# Altium project test.prjpcb
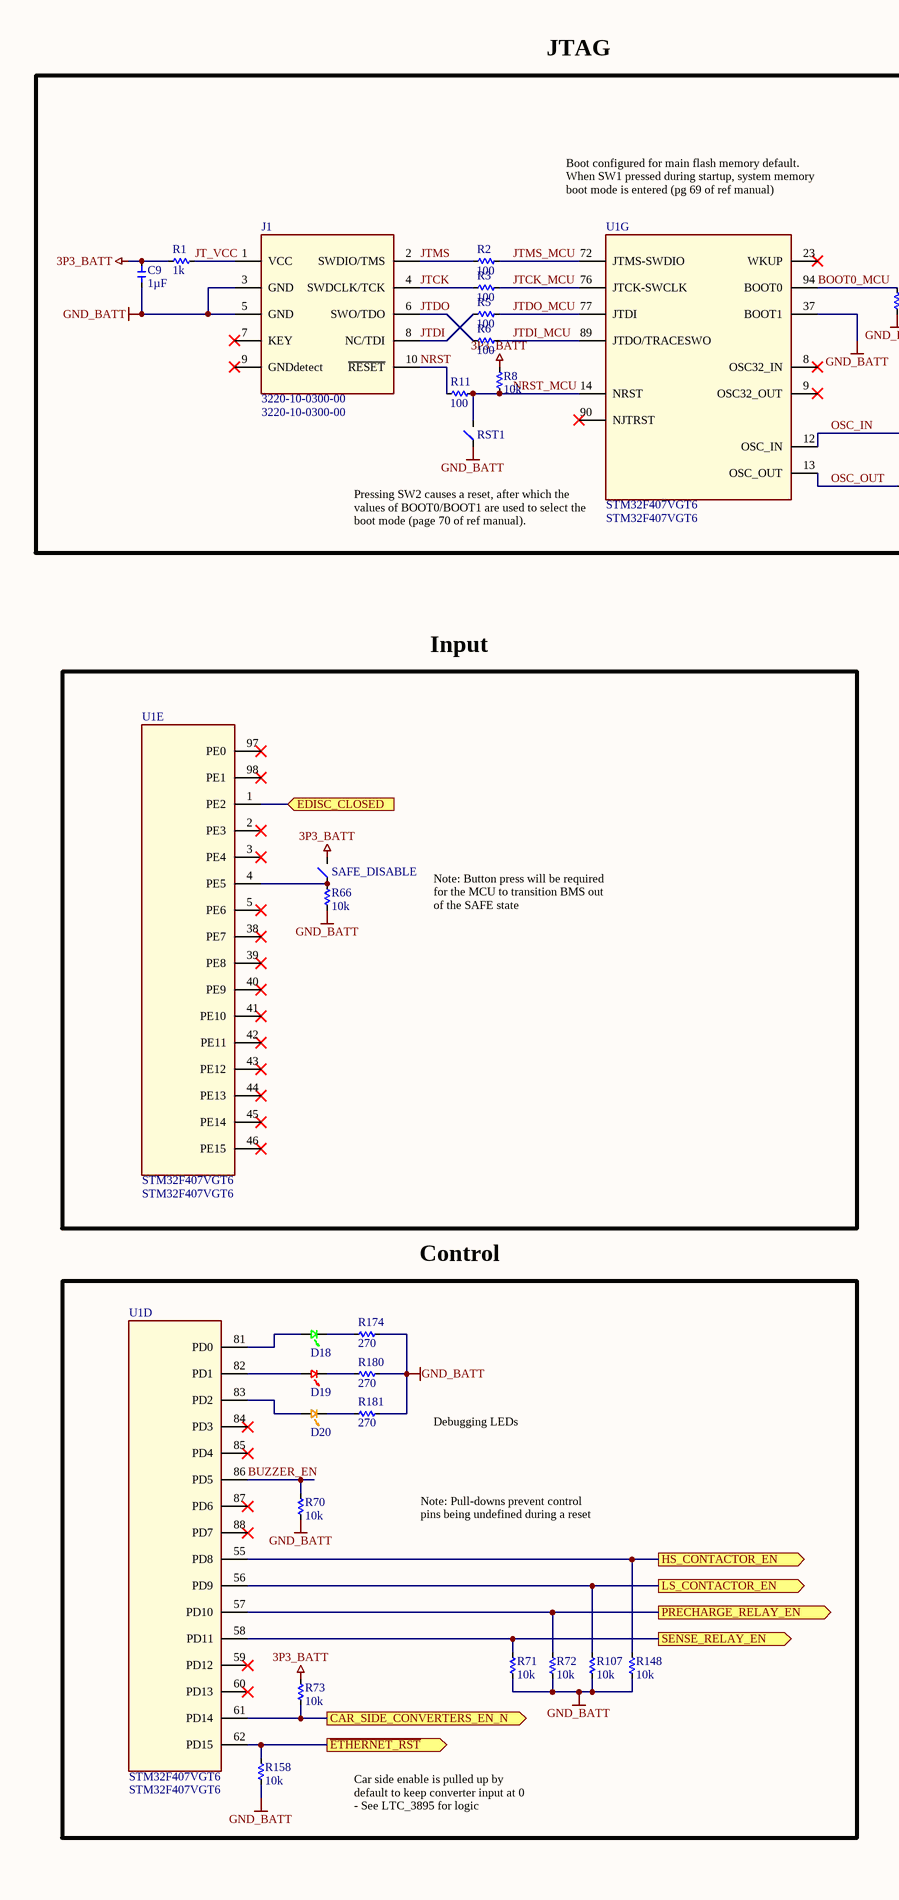
[diagram p0: sheet1.SchDoc, left]
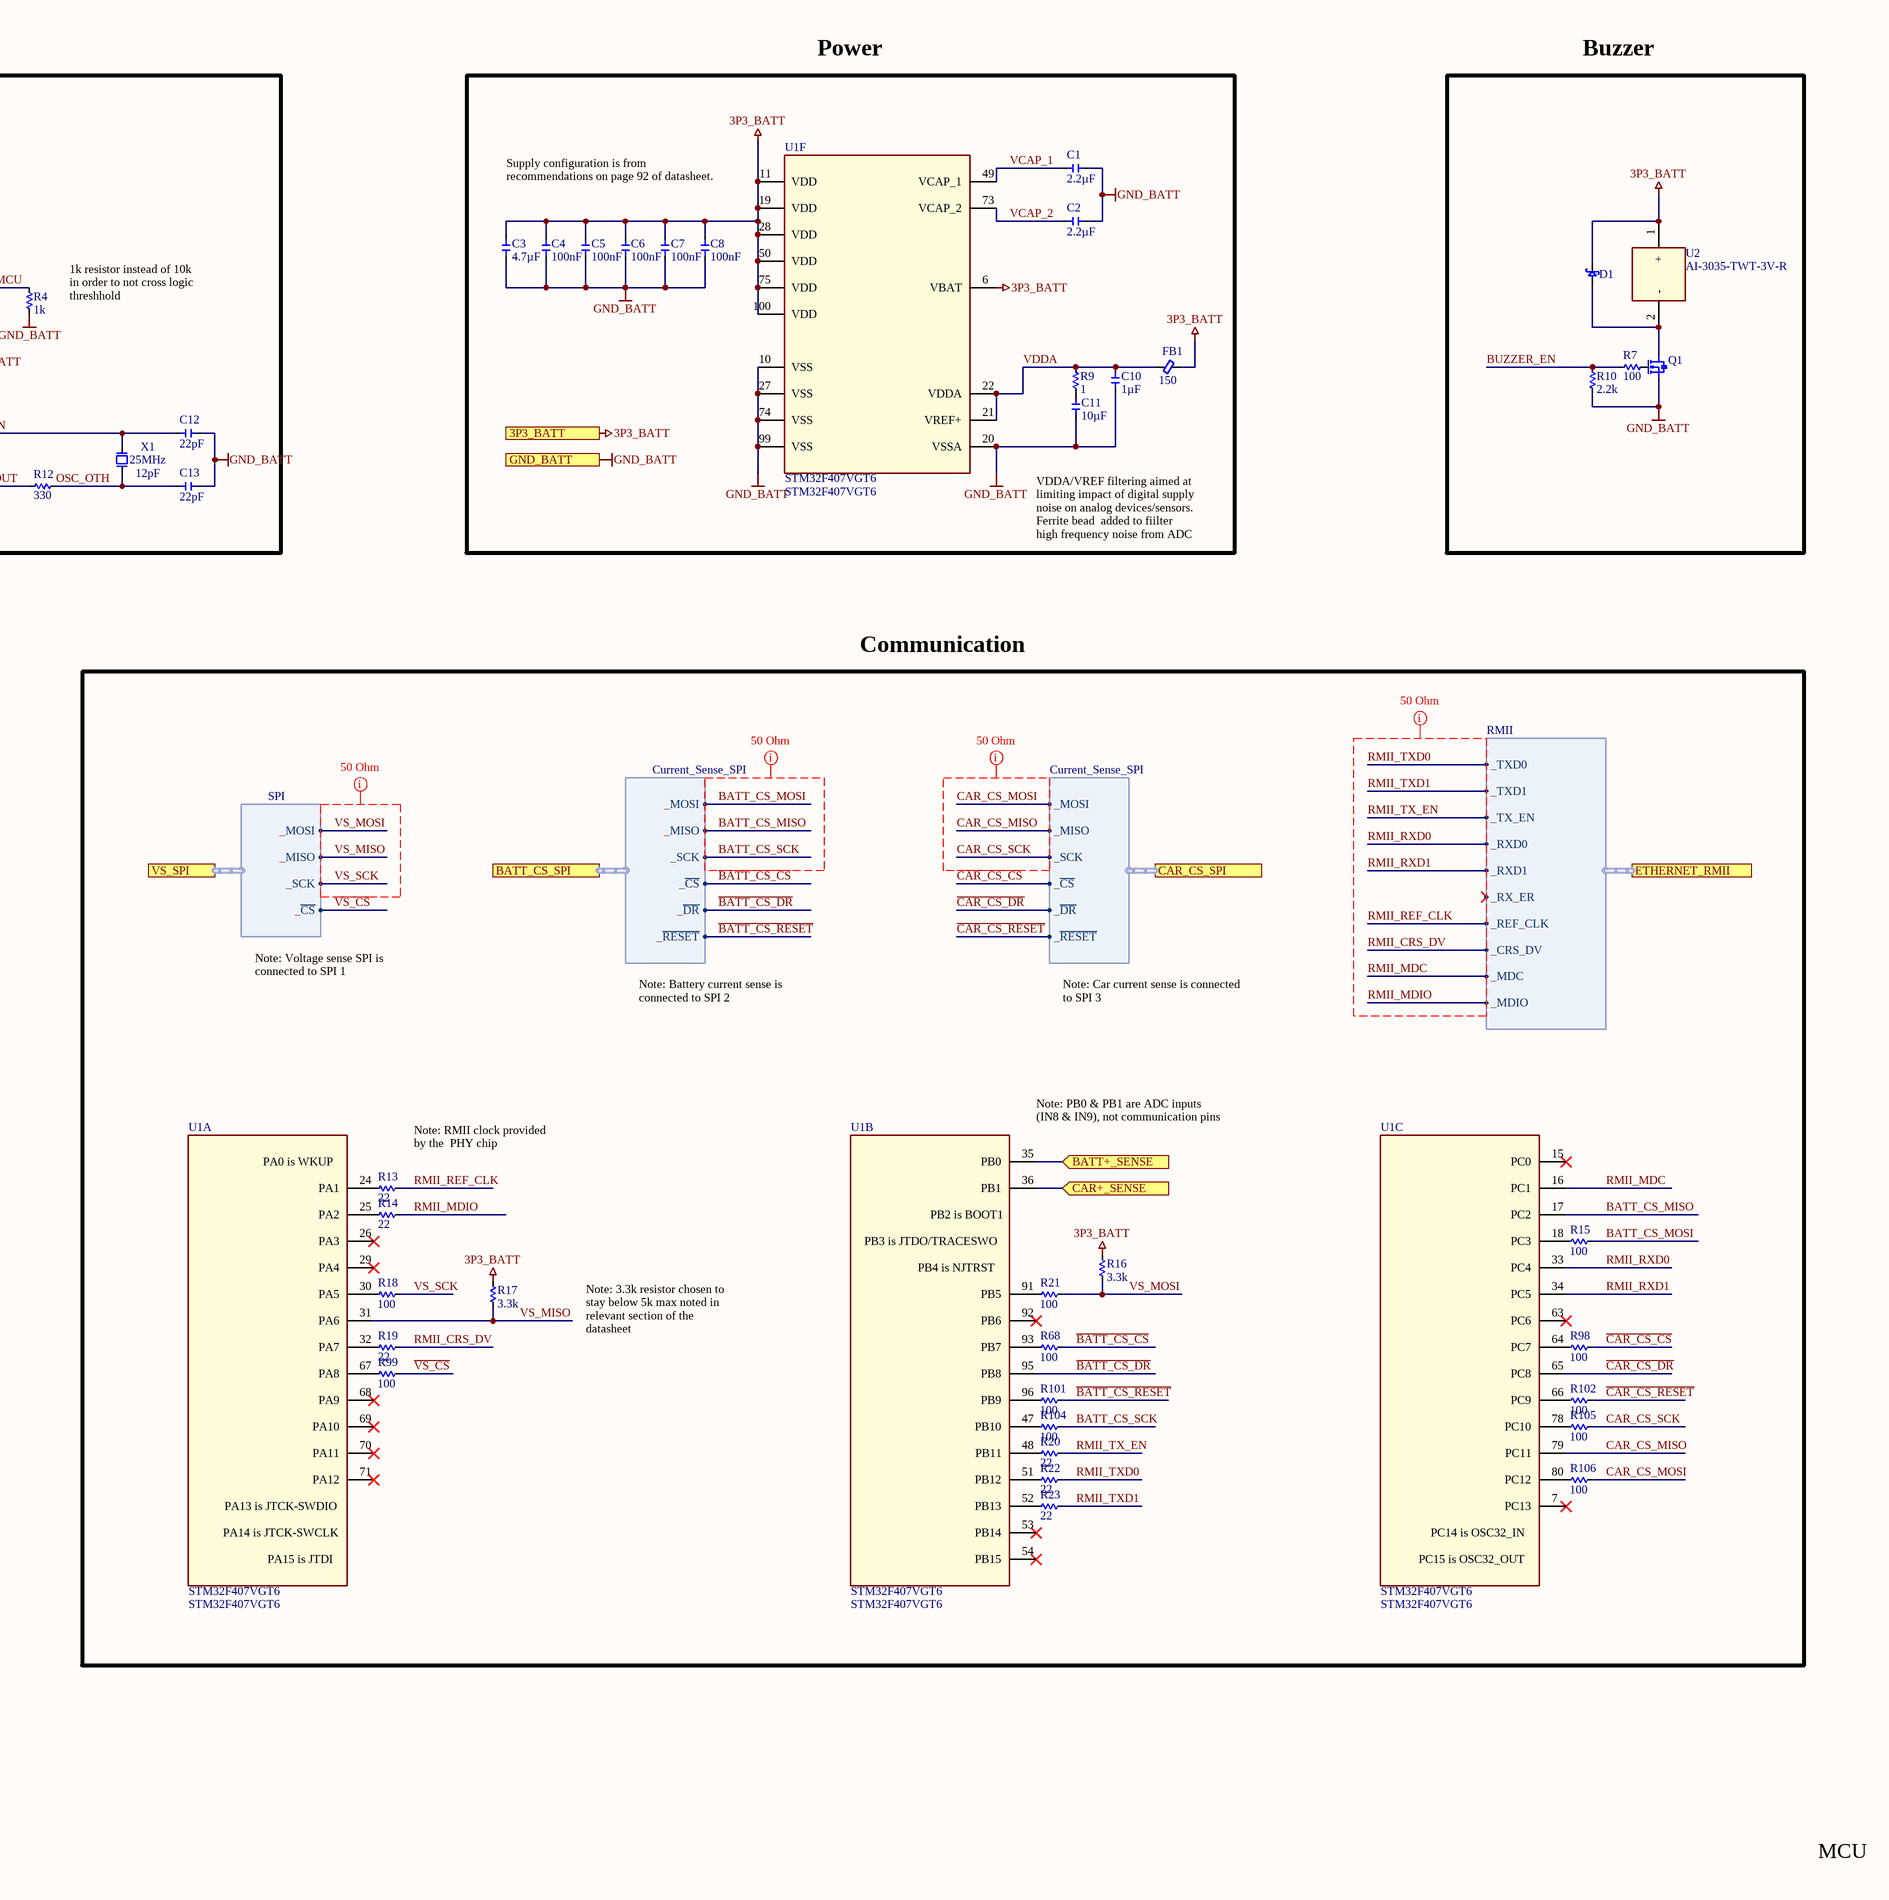
[diagram p1: sheet1.SchDoc, right]
PrjCustomer: My Project; PrjName: BMS_11; PrjPCARev: 1; PrjPCBRev: 1; PrjSVN: 28; PrjYear: 2021
2 sheets, 127 parts. Net scope: strictly hierarchical (ports join the sheet entries above them; power ports are local).
Board file: BMS_11_1_0.PcbDoc
Sheets:
  sheet1.SchDoc
  sheet2.SchDoc

## Sheet sheet1.SchDoc
size 558 x 381 mm; DocumentNumber: 11; SheetNumber: 10; SheetTotal: 19

### Parts
C1  value 2.2µF  [C0603_0.90MM]  (hidden comment: CGA3E1X7S1C225K080AC)
C2  value 2.2µF  [C0603_0.90MM]  (hidden comment: CGA3E1X7S1C225K080AC)
C3  value 4.7µF  [C0805_1.45MM]  (hidden comment: CGA4J3X7R1C475K125AB)
C4  value 100nF  [C0603_0.90MM]  (hidden comment: CGA3E2X7R1H104K080AA)
C5  value 100nF  [C0603_0.90MM]  (hidden comment: CGA3E2X7R1H104K080AA)
C6  value 100nF  [C0603_0.90MM]  (hidden comment: CGA3E2X7R1H104K080AA)
C7  value 100nF  [C0603_0.90MM]  (hidden comment: CGA3E2X7R1H104K080AA)
C8  value 100nF  [C0603_0.90MM]  (hidden comment: CGA3E2X7R1H104K080AA)
C9  value 1µF  [C0805_1.50MM]  (hidden comment: CGA4J3X7R1H105K125AB)
C10  value 1µF  [C0805_1.50MM]  (hidden comment: CGA4J3X7R1H105K125AB)
C11  value 10µF  [C1210_2.80MM]  (hidden comment: CGA6P1X7R1E106K250AC)
C12  value 22pF  [C0603_0.90MM]  (hidden comment: CGA3E2C0G1H220J080AA)
C13  value 22pF  [C0603_0.90MM]  (hidden comment: CGA3E2C0G1H220J080AA)
D1  DFLS130L-7  [DIOD-POWERDI123-2_A_V]  (value not drawn)
D18  LTST-C191KGKT  [LED_0603P_GREEN]  (value not drawn)
D19  LTST-C194KRKT  [LED_0603P_RED]  (value not drawn)
D20  LTST-C194KFKT  [LED_0603P_ORANGE]  (value not drawn)
FB1  Impedance (Ohms @ 100MHz): 150  [FB0603_0.95MM]  (hidden comment: MPZ1608Y151BTD25)
J1  3220-10-0300-00  [3220-10-0300-00]
Q1  BSR802NL6327  [3SOT23]  (value not drawn)
R1  value 1k  [R0603_0.55MM]  (hidden comment: ERJ-PA3F1001V)
R2  value 100  [R0603_0.55MM]  (hidden comment: ERJ-3EKF1000V)
R3  value 100  [R0603_0.55MM]  (hidden comment: ERJ-3EKF1000V)
R4  value 1k  [R0603_0.55MM]  (hidden comment: ERJ-PA3F1001V)
R5  value 100  [R0603_0.55MM]  (hidden comment: ERJ-3EKF1000V)
R6  value 100  [R0603_0.55MM]  (hidden comment: ERJ-3EKF1000V)
R7  value 100  [R0603_0.55MM]  (hidden comment: ERJ-PA3F1000V)
R8  value 10k  [R0603_0.55MM]  (hidden comment: ERJ-3EKF1002V)
R9  value 1  [R0603_0.55MM]  (hidden comment: ERJ-3RQF1R0V)
R10  value 2.2k  [R0603_0.55MM]  (hidden comment: ERJ-PA3F2201V)
R11  value 100  [R0603_0.55MM]  (hidden comment: ERJ-3EKF1000V)
R12  value 330  [R0603_0.55MM]  (hidden comment: ERJ-3EKF3300V)
R13  value 22  [R0603_0.55MM]  (hidden comment: ERJ-3EKF22R0V)
R14  value 22  [R0603_0.55MM]  (hidden comment: ERJ-3EKF22R0V)
R15  value 100  [R0603_0.55MM]  (hidden comment: ERJ-3EKF1000V)
R16  value 3.3k  [R0603_0.55MM]  (hidden comment: ERJ-3EKF3301V)
R17  value 3.3k  [R0603_0.55MM]  (hidden comment: ERJ-3EKF3301V)
R18  value 100  [R0603_0.55MM]  (hidden comment: ERJ-3EKF1000V)
R19  value 22  [R0603_0.55MM]  (hidden comment: ERJ-3EKF22R0V)
R20  value 22  [R0603_0.55MM]  (hidden comment: ERJ-3EKF22R0V)
R21  value 100  [R0603_0.55MM]  (hidden comment: ERJ-3EKF1000V)
R22  value 22  [R0603_0.55MM]  (hidden comment: ERJ-3EKF22R0V)
R23  value 22  [R0603_0.55MM]  (hidden comment: ERJ-3EKF22R0V)
R66  value 10k  [R0603_0.55MM]  (hidden comment: ERJ-3EKF1002V)
R68  value 100  [R0603_0.55MM]  (hidden comment: ERJ-3EKF1000V)
R70  value 10k  [R0603_0.55MM]  (hidden comment: ERJ-3EKF1002V)
R71  value 10k  [R0603_0.55MM]  (hidden comment: ERJ-3EKF1002V)
R72  value 10k  [R0603_0.55MM]  (hidden comment: ERJ-3EKF1002V)
R73  value 10k  [R0603_0.55MM]  (hidden comment: ERJ-3EKF1002V)
R98  value 100  [R0603_0.55MM]  (hidden comment: ERJ-3EKF1000V)
R99  value 100  [R0603_0.55MM]  (hidden comment: ERJ-3EKF1000V)
R101  value 100  [R0603_0.55MM]  (hidden comment: ERJ-3EKF1000V)
R102  value 100  [R0603_0.55MM]  (hidden comment: ERJ-3EKF1000V)
R104  value 100  [R0603_0.55MM]  (hidden comment: ERJ-3EKF1000V)
R105  value 100  [R0603_0.55MM]  (hidden comment: ERJ-3EKF1000V)
R106  value 100  [R0603_0.55MM]  (hidden comment: ERJ-3EKF1000V)
R107  value 10k  [R0603_0.55MM]  (hidden comment: ERJ-3EKF1002V)
R148  value 10k  [R0603_0.55MM]  (hidden comment: ERJ-3EKF1002V)
R158  value 10k  [R0603_0.55MM]  (hidden comment: ERJ-3EKF1002V)
R174  value 270  [R0603_0.55MM]  (hidden comment: ERJ-PA3F2700V)
R180  value 270  [R0603_0.55MM]  (hidden comment: ERJ-PA3F2700V)
R181  value 270  [R0603_0.55MM]  (hidden comment: ERJ-PA3F2700V)
RST1  B3U-1000P  [SWITCH_B3U-1000P]  (value not drawn)
SAFE_DISABLE  B3U-1000P  [SWITCH_B3U-1000P]  (value not drawn)
U1  STM32F407VGT6  [QFP50P1600X1600X160-100N]  (parts A,B,C,D,E,F,G of 7)
U2  AI-3035-TWT-3V-R  [New footprint 1]
X1  Load Capacitance: 12pF  Frequency: 25MHz  [4_SMD_2.0x1.6mm]  (hidden comment: CX2016DB25000H0FLJC1)

### Blocks framed on the sheet
JTAG: C9 C12 C13 J1 R1-R6 R8 R11 R12 RST1 U1 X1
Power: C1-C8 C10 C11 FB1 R9 U1
Buzzer: D1 Q1 R7 R10 U2
Input: R66 SAFE_DISABLE U1
Communication: R13-R23 R68 R98 R99 R101 R102 R104-R106 U1
Control: D18-D20 R70-R73 R107 R148 R158 R174 R180 R181 U1

### Ports
3P3_BATT, BATT+_SENSE (in), BATT_CS_SPI (harness Current_Sense_SPI), CAR+_SENSE (in), CAR_CS_SPI (harness Current_Sense_SPI), CAR_SIDE_CONVERTERS_EN_N (out), EDISC_CLOSED (in), ETHERNET_RMII (harness RMII), GND_BATT, HS_CONTACTOR_EN (out), LS_CONTACTOR_EN (out), PRECHARGE_RELAY_EN (out), SENSE_RELAY_EN (out), VS_SPI (harness SPI), ~{ETHERNET_RST} (out)

### Harnesses
RMII: _TXD0, _TXD1, _TX_EN, _REF_CLK, _RXD0, _RXD1, _RX_ER, _CRS_DV, _MDC, _MDIO
SPI: _MOSI, _MISO, _SCK, _~{CS}
Current_Sense_SPI: _MOSI, _MISO, _SCK, _~{CS}, _~{RESET}, _~{DR}

### Nets
3P3_BATT: C3.1 C4.1 C5.1 C6.1 C7.1 C8.1 C9.1 D1.2 FB1.2 R1.1 R8.1 R16.1 R17.1 R73.1 SAFE_DISABLE.2 U1.6(VBAT) U1.11(VDD) U1.19(VDD) U1.28(VDD) U1.50(VDD) U1.75(VDD) U1.100(VDD) U2.1(+) ; port 3P3_BATT
GND_BATT: C1.2 C2.2 C3.2 C4.2 C5.2 C6.2 C7.2 C8.2 C9.2 C10.2 C11.2 C12.2 C13.2 J1.3(GND) J1.5(GND) Q1.2 R4.2 R10.2 R66.2 R70.2 R71.2 R72.2 R107.2 R148.2 R158.2 R174.2 R180.1 R181.2 RST1.1 U1.10(VSS) U1.20(VSSA) U1.27(VSS) U1.37(BOOT1) U1.74(VSS) U1.99(VSS) ; port GND_BATT
~{BATT_CS_CS}: R68.2 ; port BATT_CS_SPI._~{CS}
~{BATT_CS_DR}: U1.95(PB8) ; port BATT_CS_SPI._~{DR}
~{BATT_CS_RESET}: R101.2 ; port BATT_CS_SPI._~{RESET}
BATT_CS_MISO: U1.17(PC2) ; port BATT_CS_SPI._MISO
BATT_CS_MOSI: R15.2 ; port BATT_CS_SPI._MOSI
BATT_CS_SCK: R104.2 ; port BATT_CS_SPI._SCK
BOOT0_MCU: R4.1 U1.94(BOOT0)
BUZZER_EN: R7.1 R10.1 R70.1 U1.86(PD5)
~{CAR_CS_CS}: R98.2 ; port CAR_CS_SPI._~{CS}
~{CAR_CS_DR}: U1.65(PC8) ; port CAR_CS_SPI._~{DR}
~{CAR_CS_RESET}: R102.2 ; port CAR_CS_SPI._~{RESET}
CAR_CS_MISO: U1.79(PC11) ; port CAR_CS_SPI._MISO
CAR_CS_MOSI: R106.2 ; port CAR_CS_SPI._MOSI
CAR_CS_SCK: R105.2 ; port CAR_CS_SPI._SCK
JT_VCC: J1.1(VCC) R1.2
JTCK: J1.4(SWDCLK/TCK) R3.1
JTCK_MCU: R3.2 U1.76(JTCK-SWCLK)
JTDI: J1.8(NC/TDI) R5.1
JTDI_MCU: R6.2 U1.89(JTDO/TRACESWO)
JTDO: J1.6(SWO/TDO) R6.1
JTDO_MCU: R5.2 U1.77(JTDI)
JTMS: J1.2(SWDIO/TMS) R2.1
JTMS_MCU: R2.2 U1.72(JTMS-SWDIO)
NRST: J1.10(~{RESET}) R11.1
NRST_MCU: R8.2 R11.2 RST1.2 U1.14(NRST)
OSC_IN: C12.1 U1.12(OSC_IN) X1.3
OSC_OTH: C13.1 R12.2 X1.1
OSC_OUT: R12.1 U1.13(OSC_OUT)
RMII_CRS_DV: R19.1 ; port ETHERNET_RMII._CRS_DV
RMII_MDC: U1.16(PC1) ; port ETHERNET_RMII._MDC
RMII_MDIO: R14.1 ; port ETHERNET_RMII._MDIO
RMII_REF_CLK: R13.1 ; port ETHERNET_RMII._REF_CLK
RMII_RXD0: U1.33(PC4) ; port ETHERNET_RMII._RXD0
RMII_RXD1: U1.34(PC5) ; port ETHERNET_RMII._RXD1
RMII_TX_EN: R20.1 ; port ETHERNET_RMII._TX_EN
RMII_TXD0: R22.1 ; port ETHERNET_RMII._TXD0
RMII_TXD1: R23.1 ; port ETHERNET_RMII._TXD1
~{VS_CS}: R99.2 ; port VS_SPI._~{CS}
VCAP_1: C1.1 U1.49(VCAP_1)
VCAP_2: C2.1 U1.73(VCAP_2)
VDDA: C10.1 FB1.1 R9.1 U1.21(VREF+) U1.22(VDDA)
VS_MISO: R17.2 U1.31(PA6) ; port VS_SPI._MISO
VS_MOSI: R16.2 R21.2 ; port VS_SPI._MOSI
VS_SCK: R18.2 ; port VS_SPI._SCK
NetC11_1: C11.1 R9.2
NetD1_1: D1.1 Q1.3 U2.2(-)
NetD18_1: D18.1 R174.1
NetD18_2: D18.2 U1.81(PD0)
NetD19_1: D19.1 R180.2
NetD19_2: D19.2 U1.82(PD1)
NetD20_1: D20.1 R181.1
NetD20_2: D20.2 U1.83(PD2)
NetQ1_1: Q1.1 R7.2
NetR13_2: R13.2 U1.24(PA1)
NetR14_2: R14.2 U1.25(PA2)
NetR15_1: R15.1 U1.18(PC3)
NetR18_1: R18.1 U1.30(PA5)
NetR19_2: R19.2 U1.32(PA7)
NetR20_2: R20.2 U1.48(PB11)
NetR21_1: R21.1 U1.91(PB5)
NetR22_2: R22.2 U1.51(PB12)
NetR23_2: R23.2 U1.52(PB13)
NetR66_1: R66.1 SAFE_DISABLE.1 U1.4(PE5)
NetR68_1: R68.1 U1.93(PB7)
NetR71_1: R71.1 U1.58(PD11) ; port SENSE_RELAY_EN
NetR72_1: R72.1 U1.57(PD10) ; port PRECHARGE_RELAY_EN
NetR73_2: R73.2 U1.61(PD14) ; port CAR_SIDE_CONVERTERS_EN_N
NetR98_1: R98.1 U1.64(PC7)
NetR99_1: R99.1 U1.67(PA8)
NetR101_1: R101.1 U1.96(PB9)
NetR102_1: R102.1 U1.66(PC9)
NetR104_1: R104.1 U1.47(PB10)
NetR105_1: R105.1 U1.78(PC10)
NetR106_1: R106.1 U1.80(PC12)
NetR107_1: R107.1 U1.56(PD9) ; port LS_CONTACTOR_EN
NetR148_1: R148.1 U1.55(PD8) ; port HS_CONTACTOR_EN
NetR158_1: R158.1 U1.62(PD15) ; port ~{ETHERNET_RST}
NetU1_1: U1.1(PE2) ; port EDISC_CLOSED
NetU1_35: U1.35(PB0) ; port BATT+_SENSE
NetU1_36: U1.36(PB1) ; port CAR+_SENSE

Not connected (* = marked no-connect by the designer): J1 7(KEY)* 9(GNDdetect)*; U1 2(PE3)* 3(PE4)* 5(PE6)* 7(PC13)* 8(OSC32_IN)* 9(OSC32_OUT)* 15(PC0)* 23(WKUP)* 26(PA3)* 29(PA4)* 38(PE7)* 39(PE8)* 40(PE9)* 41(PE10)* 42(PE11)* 43(PE12)* 44(PE13)* 45(PE14)* 46(PE15)* 53(PB14)* 54(PB15)* 59(PD12)* 60(PD13)* 63(PC6)* 68(PA9)* 69(PA10)* 70(PA11)* 71(PA12)* 84(PD3)* 85(PD4)* 87(PD6)* 88(PD7)* 90(NJTRST)* 92(PB6)* 97(PE0)* 98(PE1)*

### Layout directives
mark named 50 Ohm: BATT_CS_MISO, BATT_CS_MOSI, BATT_CS_SCK, CAR_CS_MISO, CAR_CS_MOSI, CAR_CS_SCK, RMII_CRS_DV, RMII_MDC, RMII_MDIO, RMII_REF_CLK, RMII_RXD0, RMII_RXD1, RMII_TX_EN, RMII_TXD0, RMII_TXD1, VS_MISO, VS_MOSI, VS_SCK

### Notes on the sheet
- Boot configured for main flash memory default. When SW1 pressed during startup, system memory boot mode is entered (pg 69 of ref manual)
- Supply configuration is from recommendations on page 92 of datasheet.
- (near R4) 1k resistor instead of 10k in order to not cross logic threshhold
- (near U1) Pressing SW2 causes a reset, after which the values of BOOT0/BOOT1 are used to select the boot mode (page 70 of ref manual).
- VDDA/VREF filtering aimed at limiting impact of digital supply noise on analog devices/sensors. Ferrite bead  added to fiilter high frequency noise from ADC pins
- Note: Button press will be required for the MCU to transition BMS out of the SAFE state
- Note: Voltage sense SPI is connected to SPI 1
- Note: Battery current sense is connected to SPI 2
- Note: Car current sense is connected to SPI 3
- Note: RMII clock provided by the  PHY chip
- (near U1) Note: PB0 & PB1 are ADC inputs (IN8 & IN9), not communication pins
- Note: 3.3k resistor chosen to stay below 5k max noted in relevant section of the datasheet
- Debugging LEDs
- Note: Pull-downs prevent control pins being undefined during a reset
- Car side enable is pulled up by default to keep converter input at 0 - See LTC_3895 for logic
- MCU
- (in symbol CMP-020-00000-1, part A) PA0 is WKUP; PA13 is JTCK-SWDIO; PA14 is JTCK-SWCLK; PA15 is JTDI
- (in symbol CMP-020-00000-1, part B) PB2 is BOOT1; PB3 is JTDO/TRACESWO; PB4 is NJTRST
- (in symbol CMP-020-00000-1, part C) PC14 is OSC32_IN; PC15 is OSC32_OUT

### Library data of the parts
C1 C2 = CMP-019-0603-1: CAP CER 2.2UF 16V X7S 0603; Manufacturer: TDK Corporation; Tolerance: 10%; Unit Price (USD): 0.3; Size / Dimension: 0.063" L x 0.031" W (1.60mm x 0.80mm); Voltage - Rated: 16V; Digi-Key Part Number: 445-16104-1-ND; Operating Temperature: -55°C ~ 125°C; ComponentLink1Description: Series Datasheet; Manufacturer Part Number: CGA3E1X7S1C225K080AC; ComponentLink1URL: https://product.tdk.com/info/en/catalog/datasheets/mlcc_automotive_general_en.pdf?ref_disty=digikey; Case/Package: 0603 (1608 Metric); Thickness (Max): 0.035" (0.90mm); Mounting Type: Surface Mount, MLCC; Series: CGA; Applications: AEC-Q200; Temperature Coefficient: X7S; Part Status: Active
C3 = CMP-019-0947-1: CAP CER 4.7UF 16V X7R 0805; Manufacturer: TDK Corporation; Unit Price (USD): 0.37; Tolerance: 10%; ComponentLink1Description: Series Datasheet; Operating Temperature: -55°C ~ 125°C; Series: CGA; Case/Package: 0805 (2012 Metric); Mounting Type: Surface Mount, MLCC; ComponentLink1URL: https://product.tdk.com/info/en/catalog/datasheets/mlcc_automotive_general_en.pdf?ref_disty=digikey; Applications: AEC-Q200; Thickness (Max): 0.057" (1.45mm); Temperature Coefficient: X7R; Voltage - Rated: 16V; Manufacturer Part Number: CGA4J3X7R1C475K125AB; Part Status: Active; Digi-Key Part Number: 445-6969-1-ND; Size / Dimension: 0.079" L x 0.049" W (2.00mm x 1.25mm)
C4-C8 = CMP-019-0462-1: CAP CER 0.1UF 50V X7R 0603; Manufacturer: TDK Corporation; Tolerance: 10%; Unit Price (USD): 0.11; Thickness (Max): 0.035" (0.90mm); Part Status: Active; ComponentLink1Description: Series Datasheet; Temperature Coefficient: X7R; Voltage - Rated: 50V; Applications: AEC-Q200; Digi-Key Part Number: 445-5666-1-ND; Series: CGA; Case/Package: 0603 (1608 Metric); Manufacturer Part Number: CGA3E2X7R1H104K080AA; Mounting Type: Surface Mount, MLCC; ComponentLink1URL: https://product.tdk.com/info/en/catalog/datasheets/mlcc_automotive_general_en.pdf?ref_disty=digikey; Size / Dimension: 0.063" L x 0.031" W (1.60mm x 0.80mm); Operating Temperature: -55°C ~ 125°C
C9 C10 = CMP-019-0976-1: CAP CER 1UF 50V X7R 0805; Manufacturer: TDK Corporation; Tolerance: 10%; Unit Price (USD): 0.48; Operating Temperature: -55°C ~ 125°C; Voltage - Rated: 50V; ComponentLink1Description: Series Datasheet; Size / Dimension: 0.079" L x 0.049" W (2.00mm x 1.25mm); Digi-Key Part Number: 445-6961-1-ND; Thickness (Max): 0.059" (1.50mm); Manufacturer Part Number: CGA4J3X7R1H105K125AB; ComponentLink1URL: https://product.tdk.com/info/en/catalog/datasheets/mlcc_automotive_general_en.pdf?ref_disty=digikey; Mounting Type: Surface Mount, MLCC; Series: CGA; Part Status: Active; Case/Package: 0805 (2012 Metric); Temperature Coefficient: X7R; Applications: AEC-Q200
C11 = CMP-019-1289-1: CAP CER 10UF 25V X7R 1210; Manufacturer: TDK Corporation; Unit Price (USD): 0.83; Tolerance: 10%; Mounting Type: Surface Mount, MLCC; Operating Temperature: -55°C ~ 125°C; Size / Dimension: 0.126" L x 0.098" W (3.20mm x 2.50mm); Series: CGA; Temperature Coefficient: X7R; Case/Package: 1210 (3225 Metric); Thickness (Max): 0.110" (2.80mm); Voltage - Rated: 25V; ComponentLink1Description: Series Datasheet; Manufacturer Part Number: CGA6P1X7R1E106K250AC; Applications: AEC-Q200; Digi-Key Part Number: 445-7000-1-ND; Part Status: Active; ComponentLink1URL: https://product.tdk.com/info/en/catalog/datasheets/mlcc_automotive_general_en.pdf?ref_disty=digikey
C12 C13 = CMP-019-0625-1: CAP CER 22PF 50V C0G 0603; Manufacturer: TDK Corporation; Tolerance: 5%; Temperature Coefficient: C0G, NP0; Unit Price (USD): 0.19; ComponentLink1URL: https://product.tdk.com/info/en/catalog/datasheets/mlcc_automotive_general_en.pdf?ref_disty=digikey; Thickness (Max): 0.035" (0.90mm); Digi-Key Part Number: 445-5632-1-ND; Manufacturer Part Number: CGA3E2C0G1H220J080AA; Part Status: Active; Size / Dimension: 0.063" L x 0.031" W (1.60mm x 0.80mm); Mounting Type: Surface Mount, MLCC; Case/Package: 0603 (1608 Metric); Applications: AEC-Q200; ComponentLink1Description: Series Datasheet; Operating Temperature: -55°C ~ 125°C; Voltage - Rated: 50V; Series: CGA
D1 = CMP-004-00002-3: DIODES INC. - DFLS130L-7 - Schottky Rectifier, POWERDI®, 30 V, 1 A, Single, PowerDI 123, 2 Pins, 360 mV; Current Rating: 1A; Max Reverse Voltage (DC): 30V; Polarity: Standard; Peak Reverse Current: 1mA; Forward Voltage: 360mV; Max Power Dissipation: 1.67W; Capacitance: 76pF; Peak Non-Repetitive Surge Current: 50A; Radiation Hardening: No; REACH SVHC: No SVHC; Lead Free: Lead Free; Element Configuration: Single; Voltage Rating (DC): 30V; Contact Plating: Tin,Matte; Max Repetitive Reverse Voltage (Vrrm): 30V; Height: 0.98mm; Length: 2.8mm; Packaging: Tape and Reel; Output Current: 1A; Termination: SMD/SMT; Width: 1.78mm; Forward Current: 1A; Package Quantity: 3000; Max Forward Surge Current (Ifsm): 50A; Mount: Surface Mount; Number of Pins: 2; Average Rectified Current: 1A; Min Operating Temperature: -40°C; Max Operating Temperature: 125°C
D18 = CMP-023-0000-3: LED GREEN CLEAR SMD; Manufacturer: Lite-On Inc.; Lens Style: Rectangle with Flat Top; Viewing Angle: 130°; Lens Size: 1.10mm x 0.80mm; Configuration: Standard; Millicandela Rating: 35mcd; Voltage - Forward (Vf) (Typ): 2V; Lens Color: Colorless; Current - Test: 20mA; Wavelength - Peak: 574nm; Wavelength - Dominant: 571nm; Supplier Device Package: -; ComponentLink1URL: http://optoelectronics.liteon.com/upload/download/DS22-2000-228/LTST-C191KGKT.PDF; Height (Max): 0.65mm; Manufacturer Part Number: LTST-C191KGKT; ComponentLink1Description: Datasheet; Size / Dimension: 1.60mm L x 0.80mm W; Mounting Type: Surface Mount; Lens Transparency: Clear; Case/Package: 0603 (1608 Metric); Part Status: Active; Digi-Key Part Number: 160-1446-6-ND; Type: -; Color: Green
D19 = CMP-023-0011-3: LED RED CLEAR SMD; Manufacturer: Lite-On Inc.; Configuration: Standard; Lens Style: Rectangle with Flat Top; Voltage - Forward (Vf) (Typ): 2V; Current - Test: 20mA; Viewing Angle: 130°; Lens Color: Colorless; Wavelength - Dominant: 631nm; Millicandela Rating: 95.6mcd; Wavelength - Peak: 639nm; Lens Size: 1.15mm x 0.80mm; Mounting Type: Surface Mount; Manufacturer Part Number: LTST-C194KRKT; Digi-Key Part Number: 160-1835-6-ND; Color: Red; Height (Max): 0.45mm; Type: -; Size / Dimension: 1.60mm L x 0.80mm W; Lens Transparency: Clear; Supplier Device Package: -; Case/Package: 0603 (1608 Metric); Part Status: Active; ComponentLink1Description: Datasheet; ComponentLink1URL: http://optoelectronics.liteon.com/upload/download/DS22-2010-0195/LTST-C194KRKT.PDF
D20 = CMP-007-00000-1: LED ORANGE CLEAR SMD; Dominant Wavelength: 605nm; Number of LEDs: 1; Forward Current: 5mA; Power Rating: 75mW; Lens Style: Diffused,Colorless,Rectangular; Lens Color: Colorless; Viewing Angle: 130°; Luminous Intensity: 162.5mcd; Test Current: 20mA; Forward Voltage: 2V; Min Operating Temperature: -30°C; Width: 0.8mm; Case/Package: 0603; Mount: Surface Mount; Illumination Color: Orange; Case Code (Metric): 1608; Length: 1.6mm; Height: 0.35mm; Max Operating Temperature: 85°C; Color: Orange; Number of Pins: 2; Package Quantity: 1; Radiation Hardening: No; Lens Transparency: Clear; Case Code (Imperial): 0603; Packaging: Tape and Reel
FB1 = CMP-024-0019-1: FERRITE BEAD 150 OHM 0603 1LN; Manufacturer: TDK Corporation; Current Rating (Max): 1.8; Filter Type: Power Line; DC Resistance (DCR) (Max): 50m; ComponentLink1URL: https://product.tdk.com/info/en/catalog/datasheets/beads_automotive_power_mpz1608_en.pdf?ref_disty=digikey; Manufacturer Part Number: MPZ1608Y151BTD25; Digi-Key Part Number: 445-172900-1-ND; Series: MPZ; Height (Max): 0.037" (0.95mm); Operating Temperature: -55°C ~ 125°C; Case/Package: 0603 (1608 Metric); Size / Dimension: 0.063" L x 0.032" W (1.60mm x 0.80mm); Mounting Type: Surface Mount; ComponentLink1Description: Datasheet; Part Status: Active
J1 = CMP-020-0003-1: CONN HEADER SMD 10POS 1.27MM; Manufacturer: CNC Tech; Current Rating: 1A; Gender: Female; Manufacturer Part Number: 3220-10-0300-00; ComponentLink1Description: Datasheet; Rated Voltage: -; Mounting Type: Surface Mount; Operating Temperature: -40°C ~ 105°C; ComponentLink1URL: http://cnctech.us/idcmatching2.pdf; Height (Max): 0.22" (5.6mm); Part Status: Active; Digi-Key Part Number: 1175-1629-ND; Size / Dimension: 0.50" L x 0.25" W (12.65mm x 6.3mm)
Q1 = CMP-013-00000-2: Infineon BSR802N L6327 N-channel MOSFET Transistor, 3.7 A, 20 V, 3-Pin SC-59; Drain to Source Breakdown Voltage: 20V; Element Configuration: Single; Rds On Max: 23mR; Threshold Voltage: 550mV; Gate to Source Voltage (Vgs): 8V; Turn-Off Delay Time: 26ns; Max Power Dissipation: 500mW; Fall Time: 18ns; Input Capacitance: 1.447nF; Continuous Drain Current (ID): 3.7A; Turn-On Delay Time: 9.8ns; Package Quantity: 3000; Max Operating Temperature: 150°C; Min Operating Temperature: -55°C; Mount: Surface Mount; REACH SVHC: No SVHC; Nominal Vgs: 550mV; Packaging: Tape and Reel; Rise Time: 18ns; Drain to Source Voltage (Vdss): 20V; Length: 3mm; Width: 1.1mm; Height: 1.6mm; Case/Package: TO-236-3; Power Dissipation: 500mW; Drain to Source Resistance: 23mR; Number of Pins: 3
R1 R4 = CMP-038-2216-1: RES SMD 1K OHM 1% 1/4W 0603; Manufacturer: Panasonic Electronic Components; Unit Price (USD): 0.14; Power (Watts): 0.25W, 1/4W; Temperature Coefficient: ±100ppm/°C; Tolerance: 1%; Features: Automotive AEC-Q200, Pulse Withstanding; ComponentLink1Description: Datasheet; Digi-Key Part Number: P1.0KBYCT-ND; Composition: Thick Film; Case/Package: 0603 (1608 Metric); Size / Dimension: 0.063" L x 0.031" W (1.60mm x 0.80mm); ComponentLink1URL: https://industrial.panasonic.com/cdbs/www-data/pdf/RDO0000/AOA0000C331.pdf; Height - Seated (Max): 0.022" (0.55mm); Supplier Device Package: 0603; Operating Temperature: -55°C ~ 155°C; Manufacturer Part Number: ERJ-PA3F1001V; Series: ERJ
R2 R3 R5 R6 R11 R15 R18 R21 R68 R98 R99 R101 R102 R104-R106 = CMP-038-1387-1: RES SMD 100 OHM 1% 1/10W 0603; Manufacturer: Panasonic Electronic Components; Unit Price (USD): 0.1; Power (Watts): 0.1W, 1/10W; Temperature Coefficient: ±100ppm/°C; Manufacturer Part Number: ERJ-3EKF1000V; ComponentLink1Description: Datasheet; ComponentLink1URL: https://industrial.panasonic.com/cdbs/www-data/pdf/RDA0000/AOA0000C304.pdf; Digi-Key Part Number: P100HCT-ND; Series: ERJ; Tolerance: 1%; Composition: Thick Film; Features: Automotive AEC-Q200; Operating Temperature: -55°C ~ 155°C; Supplier Device Package: 0603; Size / Dimension: 0.063" L x 0.031" W (1.60mm x 0.80mm); Height - Seated (Max): 0.022" (0.55mm); Case/Package: 0603 (1608 Metric)
R7 = CMP-038-1389-1: RES SMD 100 OHM 1% 1/4W 0603; Manufacturer: Panasonic Electronic Components; Temperature Coefficient: ±100ppm/°C; Power (Watts): 0.25W, 1/4W; Unit Price (USD): 0.14; Size / Dimension: 0.063" L x 0.031" W (1.60mm x 0.80mm); Manufacturer Part Number: ERJ-PA3F1000V; Tolerance: 1%; Features: Automotive AEC-Q200, Pulse Withstanding; ComponentLink1URL: https://industrial.panasonic.com/cdbs/www-data/pdf/RDO0000/AOA0000C331.pdf; ComponentLink1Description: Datasheet; Operating Temperature: -55°C ~ 155°C; Height - Seated (Max): 0.022" (0.55mm); Series: ERJ; Case/Package: 0603 (1608 Metric); Composition: Thick Film; Supplier Device Package: 0603; Digi-Key Part Number: P100BYCT-ND
R8 R66 R70-R73 R107 R148 R158 = CMP-038-3048-1: RES SMD 10K OHM 1% 1/10W 0603; Manufacturer: Panasonic Electronic Components; Unit Price (USD): 0.1; Temperature Coefficient: ±100ppm/°C; Power (Watts): 0.1W, 1/10W; Supplier Device Package: 0603; ComponentLink1Description: Datasheet; Case/Package: 0603 (1608 Metric); Manufacturer Part Number: ERJ-3EKF1002V; Series: ERJ; Size / Dimension: 0.063" L x 0.031" W (1.60mm x 0.80mm); Features: Automotive AEC-Q200; ComponentLink1URL: https://industrial.panasonic.com/cdbs/www-data/pdf/RDA0000/AOA0000C304.pdf; Operating Temperature: -55°C ~ 155°C; Digi-Key Part Number: P10.0KHCT-ND; Composition: Thick Film; Height - Seated (Max): 0.022" (0.55mm); Tolerance: 1%
R9 = CMP-038-0386-1: RES SMD 1 OHM 1% 1/10W 0603; Manufacturer: Panasonic Electronic Components; Temperature Coefficient: ±200ppm/°C; Unit Price (USD): 0.18; Power (Watts): 0.1W, 1/10W; Tolerance: 1%; ComponentLink1Description: Datasheet; Digi-Key Part Number: P1.0AJCT-ND; Size / Dimension: 0.063" L x 0.031" W (1.60mm x 0.80mm); Series: ERJ; Supplier Device Package: 0603; Case/Package: 0603 (1608 Metric); Manufacturer Part Number: ERJ-3RQF1R0V; ComponentLink1URL: https://industrial.panasonic.com/cdbs/www-data/pdf/RDN0000/AOA0000C313.pdf; Operating Temperature: -55°C ~ 125°C; Height - Seated (Max): 0.022" (0.55mm); Composition: Thick Film; Features: Automotive AEC-Q200, Current Sense
R10 = CMP-038-2493-1: RES SMD 2.2K OHM 1% 1/4W 0603; Manufacturer: Panasonic Electronic Components; Temperature Coefficient: ±100ppm/°C; Unit Price (USD): 0.14; Power (Watts): 0.25W, 1/4W; Composition: Thick Film; Height - Seated (Max): 0.022" (0.55mm); Supplier Device Package: 0603; Tolerance: 1%; Manufacturer Part Number: ERJ-PA3F2201V; Size / Dimension: 0.063" L x 0.031" W (1.60mm x 0.80mm); Digi-Key Part Number: P2.2KBYCT-ND; ComponentLink1Description: Datasheet; Series: ERJ; Case/Package: 0603 (1608 Metric); Operating Temperature: -55°C ~ 155°C; Features: Automotive AEC-Q200, Pulse Withstanding; ComponentLink1URL: https://industrial.panasonic.com/cdbs/www-data/pdf/RDO0000/AOA0000C331.pdf
R12 = CMP-038-1806-1: RES SMD 330 OHM 1% 1/10W 0603; Manufacturer: Panasonic Electronic Components; Temperature Coefficient: ±100ppm/°C; Unit Price (USD): 0.1; Power (Watts): 0.1W, 1/10W; Size / Dimension: 0.063" L x 0.031" W (1.60mm x 0.80mm); Digi-Key Part Number: P330HCT-ND; Manufacturer Part Number: ERJ-3EKF3300V; ComponentLink1Description: Datasheet; Composition: Thick Film; Operating Temperature: -55°C ~ 155°C; Case/Package: 0603 (1608 Metric); Supplier Device Package: 0603; Series: ERJ; Tolerance: 1%; Features: Automotive AEC-Q200; Height - Seated (Max): 0.022" (0.55mm); ComponentLink1URL: https://industrial.panasonic.com/cdbs/www-data/pdf/RDA0000/AOA0000C304.pdf
R13 R14 R19 R20 R22 R23 = CMP-038-0832-1: RES SMD 22 OHM 1% 1/10W 0603; Manufacturer: Panasonic Electronic Components; Temperature Coefficient: ±100ppm/°C; Unit Price (USD): 0.1; Power (Watts): 0.1W, 1/10W; Digi-Key Part Number: P22.0HCT-ND; ComponentLink1Description: Datasheet; Series: ERJ; ComponentLink1URL: https://industrial.panasonic.com/cdbs/www-data/pdf/RDA0000/AOA0000C304.pdf; Manufacturer Part Number: ERJ-3EKF22R0V; Operating Temperature: -55°C ~ 155°C; Composition: Thick Film; Case/Package: 0603 (1608 Metric); Supplier Device Package: 0603; Features: Automotive AEC-Q200; Tolerance: 1%; Height - Seated (Max): 0.022" (0.55mm); Size / Dimension: 0.063" L x 0.031" W (1.60mm x 0.80mm)
R16 R17 = CMP-038-2641-1: RES SMD 3.3K OHM 1% 1/10W 0603; Manufacturer: Panasonic Electronic Components; Power (Watts): 0.1W, 1/10W; Temperature Coefficient: ±100ppm/°C; Unit Price (USD): 0.1; ComponentLink1Description: Datasheet; Digi-Key Part Number: P3.30KHCT-ND; Height - Seated (Max): 0.022" (0.55mm); Features: Automotive AEC-Q200; Case/Package: 0603 (1608 Metric); Tolerance: 1%; Composition: Thick Film; Operating Temperature: -55°C ~ 155°C; Size / Dimension: 0.063" L x 0.031" W (1.60mm x 0.80mm); Series: ERJ; Supplier Device Package: 0603; Manufacturer Part Number: ERJ-3EKF3301V; ComponentLink1URL: https://industrial.panasonic.com/cdbs/www-data/pdf/RDA0000/AOA0000C304.pdf
R174 R180 R181 = CMP-038-1734-1: RES SMD 270 OHM 1% 1/4W 0603; Manufacturer: Panasonic Electronic Components; Unit Price (USD): 0.14; Temperature Coefficient: ±100ppm/°C; Power (Watts): 0.25W, 1/4W; Case/Package: 0603 (1608 Metric); Size / Dimension: 0.063" L x 0.031" W (1.60mm x 0.80mm); Features: Automotive AEC-Q200, Pulse Withstanding; Tolerance: 1%; Digi-Key Part Number: P270BYCT-ND; Manufacturer Part Number: ERJ-PA3F2700V; Series: ERJ; ComponentLink1URL: https://industrial.panasonic.com/cdbs/www-data/pdf/RDO0000/AOA0000C331.pdf; Operating Temperature: -55°C ~ 155°C; Height - Seated (Max): 0.022" (0.55mm); Composition: Thick Film; Supplier Device Package: 0603; ComponentLink1Description: Datasheet
RST1 SAFE_DISABLE = CMP-034-0000-1: SWITCH TACTILE SPST-NO 0.05A 12V; Manufacturer: Omron Electronics Inc-EMC Div; Switch Function: Off-Mom; Operating Force: 153gf; Actuator Orientation: Top Actuated; Actuator Type: Standard; Contact Rating @ Voltage: 0.05A @ 12VDC; Ingress Protection: Dust Proof; Illumination: Non-Illuminated; Height (Max): 1.60mm; Features: -; Manufacturer Part Number: B3U-1000P; ComponentLink1Description: Datasheet; Operating Temperature: -25°C ~ 70°C; Series: B3U; ComponentLink1URL: https://omronfs.omron.com/en_US/ecb/products/pdf/en-b3u.pdf; Termination Style: SMD (SMT) Tab; Mounting Type: Surface Mount; Circuit: SPST-NO; Illumination Voltage (Nominal): -; Illumination Type, Color: -; Size / Dimension: 3.00mm x 2.50mm; Part Status: Active; Digi-Key Part Number: SW1020CT-ND
U1 = CMP-020-00000-1: MCU 32-bit STM32F ARM Cortex M4F RISC 1024KB Flash 2.5V/3.3V 100-Pin LQFP Tray; Manufacturer: STMicroelectronics; Address Bus Width: 32b; Number of Programmable I/O: 82; Number of SPI Channels: 3; Min Supply Voltage: 1.8V; Number of Timers/Counters: 14; Max Supply Voltage: 3.6V; Peripherals: Brown-out Detect/Reset,POR,PWM,WDT,DMA,LCD,I2C; Watchdog Timer: Yes; Number of PWM Channels: 2; Number of Ethernet Channels: 1; Frequency: 168MHz; RAM Size: 196KB; Oscillator Type: Internal; Number of ADC Channels: 16; Interface: I2C,SPI,CAN,I2S,UART,USB,Ethernet,IrDA,USART,LIN,EBI/EMI; Manufacturer Part Number: STM32F407VGT6; ComponentLink1URL: https://www.digikey.com/product-detail/en/stmicroelectronics/STM32F427VGT7/497-16769-ND/6207474; Min Operating Temperature: -40°C; Width: 14.2mm; Series: STM32 F4; Memory Size: 1024KB; Core Architecture: ARM; Length: 14.2mm; Number of Pins: 100; Number of I/Os: 82; ComponentLink1Description: Datasheet; Data Bus Width: 32b; Packaging: Tray; Lead Free: Lead Free; Max Frequency: 168MHz; Height: 1.45mm; Max Operating Temperature: 85°C; RoHS Compliant: Yes; Category: Microcontrollers; REACH SVHC: No SVHC; Memory Type: FLASH; Number of I2C Channels: 3; Case/Package: LQFP; Number of UART Channels: 2; Package Quantity: 90; Radiation Hardening: No
U2 = CMP-001-0002-1: Audio Indicator Indicator Piezo 3Vdc 9mA Pin 2Vdc 3000Hz to 4000Hz Through Hole; Manufacturer: Projects Unlimited; Max Supply Voltage (DC): 5V; Washable: Yes; Voltage Rating (DC): 3V; Frequency: 3.5kHz; Min Supply Voltage (DC): 2V; Input Type: DC; Packaging: Tray; Max Operating Temperature: 80°C; Category: Audio Products; Width: 30mm; Max Supply Current: 9mA; Min Operating Temperature: -20°C; Mount: Through Hole; Height: 20.5mm; Contact Plating: Tin; Length: 30mm; Current Rating: 9mA; Termination: PC Pins; Package Quantity: 50; Manufacturer Part Number: AI-3035-TWT-3V-R; Diameter: 30mm; Operating Supply Current: 9mA; Series: AI; Nominal Supply Voltage (DC): 3V
X1 = CMP-035-0000-1: CRYSTAL 25.0000MHZ 12PF SMD; Manufacturer: Kyocera International Inc. Electronic Components; ESR (Equivalent Series Resistance): 150 Ohms; Frequency Tolerance: ±10ppm; Operating Mode: Fundamental; Frequency Stability: ±15ppm; ComponentLink1Description: Datasheet; Part Status: Active; Manufacturer Part Number: CX2016DB25000H0FLJC1; ComponentLink1URL: https://media.digikey.com/pdf/Data%20Sheets/AVX%20PDFs/CX2016DB_USY1M-H1-16426-00_Spec.pdf; Type: MHz Crystal; Digi-Key Part Number: 1253-1709-1-ND; Mounting Type: Surface Mount; Case/Package: 4-SMD, No Lead; Operating Temperature: -30°C ~ 85°C; Size / Dimension: 0.079" L x 0.063" W (2.00mm x 1.60mm); Height: 0.018" (0.45mm)

## Sheet sheet2.SchDoc
size A; DocumentNumber: 19; SheetNumber: 15; SheetTotal: 19
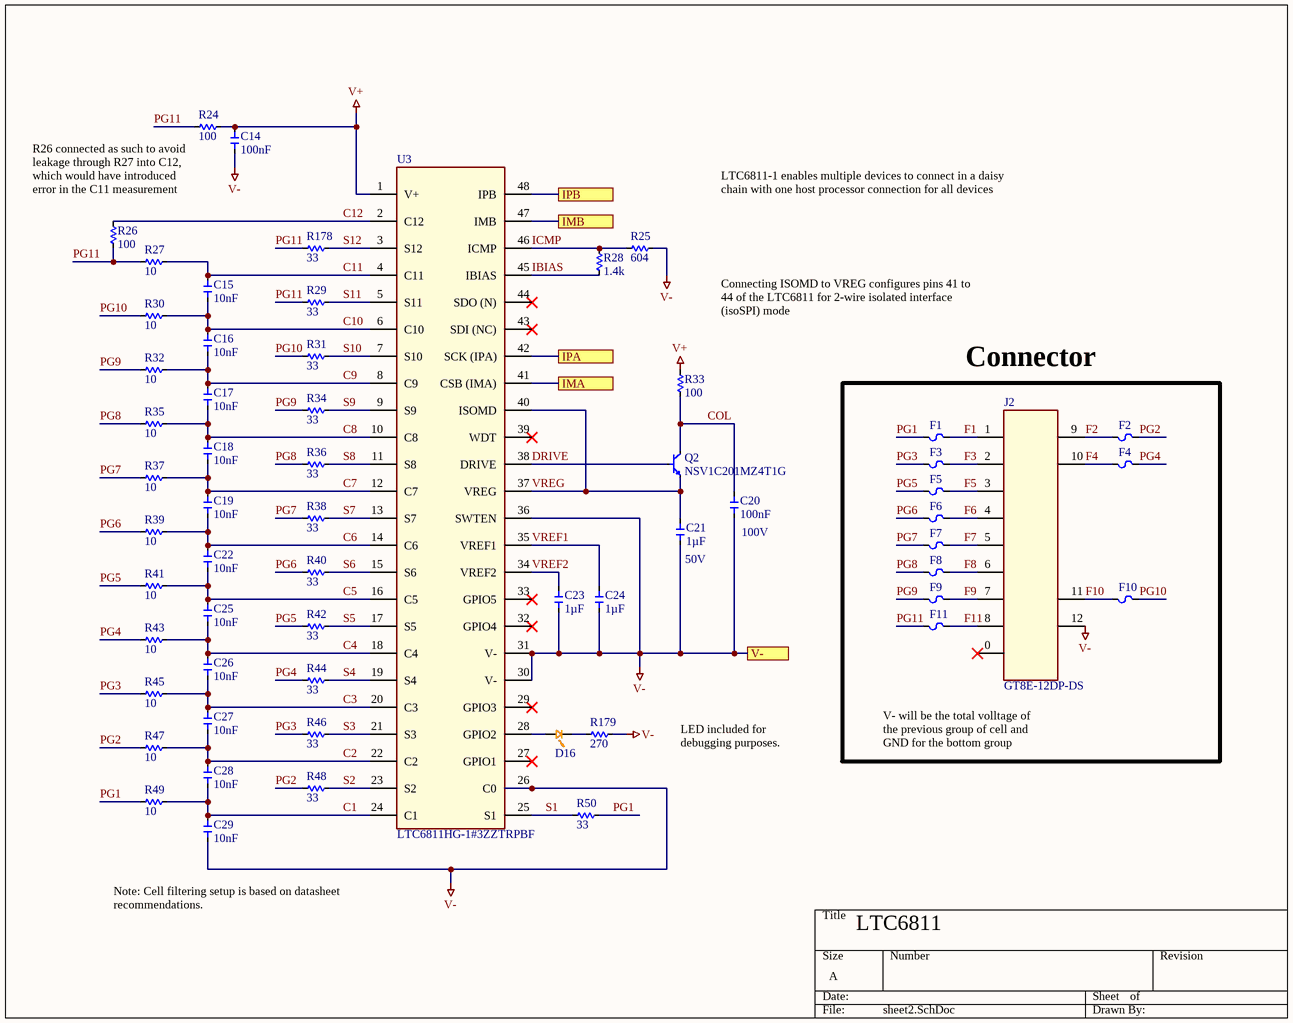
[diagram p2: sheet2.SchDoc]

### Parts
C14  value 100nF  [C0603_0.80MM]  (hidden comment: CGJ3E3X7S2A104K080AA)
C15  value 10nF  [C0603_0.90MM]  (hidden comment: CGA3E2C0G1H103J080AA)
C16  value 10nF  [C0603_0.90MM]  (hidden comment: CGA3E2C0G1H103J080AA)
C17  value 10nF  [C0603_0.90MM]  (hidden comment: CGA3E2C0G1H103J080AA)
C18  value 10nF  [C0603_0.90MM]  (hidden comment: CGA3E2C0G1H103J080AA)
C19  value 10nF  [C0603_0.90MM]  (hidden comment: CGA3E2C0G1H103J080AA)
C20  value 100nF  Voltage - Rated: 100V  [C0603_0.80MM]  (hidden comment: CGJ3E3X7S2A104K080AA)
C21  value 1µF  Voltage - Rated: 50V  [C0805_1.45MM]  (hidden comment: CGA4J3X5R1H105K125AB)
C22  value 10nF  [C0603_0.90MM]  (hidden comment: CGA3E2C0G1H103J080AA)
C23  value 1µF  [C0805_1.45MM]  (hidden comment: CGA4J3X5R1H105K125AB)
C24  value 1µF  [C0805_1.45MM]  (hidden comment: CGA4J3X5R1H105K125AB)
C25  value 10nF  [C0603_0.90MM]  (hidden comment: CGA3E2C0G1H103J080AA)
C26  value 10nF  [C0603_0.90MM]  (hidden comment: CGA3E2C0G1H103J080AA)
C27  value 10nF  [C0603_0.90MM]  (hidden comment: CGA3E2C0G1H103J080AA)
C28  value 10nF  [C0603_0.90MM]  (hidden comment: CGA3E2C0G1H103J080AA)
C29  value 10nF  [C0603_0.90MM]  (hidden comment: CGA3E2C0G1H103J080AA)
D16  LTST-C194KFKT  [LED_0603P_ORANGE]  (value not drawn)
F1  C2Q 250  [R0603_0.50MM]  (value not drawn)
F2  C2Q 250  [R0603_0.50MM]  (value not drawn)
F3  C2Q 250  [R0603_0.50MM]  (value not drawn)
F4  C2Q 250  [R0603_0.50MM]  (value not drawn)
F5  C2Q 250  [R0603_0.50MM]  (value not drawn)
F6  C2Q 250  [R0603_0.50MM]  (value not drawn)
F7  C2Q 250  [R0603_0.50MM]  (value not drawn)
F8  C2Q 250  [R0603_0.50MM]  (value not drawn)
F9  C2Q 250  [R0603_0.50MM]  (value not drawn)
F10  C2Q 250  [R0603_0.50MM]  (value not drawn)
F11  C2Q 250  [R0603_0.50MM]  (value not drawn)
J2  GT8E-12DP-DS  [GT8E-12DP-DS]
Q2  NSV1C201MZ4T1G  [NPN]
R24  value 100  [R0805_0.70MM]  (hidden comment: ERJ-P06F1000V)
R25  value 604  [R0603_0.55MM]  (hidden comment: ERJ-3EKF6040V)
R26  value 100  [R0603_0.55MM]  (hidden comment: ERJ-3EKF1000V)
R27  value 10  [R0603_0.55MM]  (hidden comment: ERJ-PA3F10R0V)
R28  value 1.4k  [R0603_0.55MM]  (hidden comment: ERJ-3EKF1401V)
R29  value 33  [R0603_0.55MM]  (hidden comment: ERJ-PA3F33R0V)
R30  value 10  [R0603_0.55MM]  (hidden comment: ERJ-PA3F10R0V)
R31  value 33  [R0603_0.55MM]  (hidden comment: ERJ-PA3F33R0V)
R32  value 10  [R0603_0.55MM]  (hidden comment: ERJ-PA3F10R0V)
R33  value 100  [R0603_0.55MM]  (hidden comment: ERJ-PA3F1000V)
R34  value 33  [R0603_0.55MM]  (hidden comment: ERJ-PA3F33R0V)
R35  value 10  [R0603_0.55MM]  (hidden comment: ERJ-PA3F10R0V)
R36  value 33  [R0603_0.55MM]  (hidden comment: ERJ-PA3F33R0V)
R37  value 10  [R0603_0.55MM]  (hidden comment: ERJ-PA3F10R0V)
R38  value 33  [R0603_0.55MM]  (hidden comment: ERJ-PA3F33R0V)
R39  value 10  [R0603_0.55MM]  (hidden comment: ERJ-PA3F10R0V)
R40  value 33  [R0603_0.55MM]  (hidden comment: ERJ-PA3F33R0V)
R41  value 10  [R0603_0.55MM]  (hidden comment: ERJ-PA3F10R0V)
R42  value 33  [R0603_0.55MM]  (hidden comment: ERJ-PA3F33R0V)
R43  value 10  [R0603_0.55MM]  (hidden comment: ERJ-PA3F10R0V)
R44  value 33  [R0603_0.55MM]  (hidden comment: ERJ-PA3F33R0V)
R45  value 10  [R0603_0.55MM]  (hidden comment: ERJ-PA3F10R0V)
R46  value 33  [R0603_0.55MM]  (hidden comment: ERJ-PA3F33R0V)
R47  value 10  [R0603_0.55MM]  (hidden comment: ERJ-PA3F10R0V)
R48  value 33  [R0603_0.55MM]  (hidden comment: ERJ-PA3F33R0V)
R49  value 10  [R0603_0.55MM]  (hidden comment: ERJ-PA3F10R0V)
R50  value 33  [R0603_0.55MM]  (hidden comment: ERJ-PA3F33R0V)
R178  value 33  [R0603_0.55MM]  (hidden comment: ERJ-PA3F33R0V)
R179  value 270  [R0603_0.55MM]  (hidden comment: ERJ-PA3F2700V)
U3  LTC6811HG-1#3ZZTRPBF  [48TSSOP50]

### Ports
IMA, IMB, IPA, IPB, V-

### Nets
V+: C14.1 R24.2 R33.1 U3.1(V+)
V-: C14.2 C20.2 C21.2 C23.2 C24.2 C29.1 J2.12 R25.2 R179.2 U3.26(C0) U3.30(V-) U3.31(V-) U3.36(SWTEN) ; port V-
C1: C28.1 C29.2 R49.2 U3.24(C1)
C2: C27.1 C28.2 R47.2 U3.22(C2)
C3: C26.1 C27.2 R45.2 U3.20(C3)
C4: C25.1 C26.2 R43.2 U3.18(C4)
C5: C22.1 C25.2 R41.2 U3.16(C5)
C6: C19.1 C22.2 R39.2 U3.14(C6)
C7: C18.1 C19.2 R37.2 U3.12(C7)
C8: C17.1 C18.2 R35.2 U3.10(C8)
C9: C16.1 C17.2 R32.2 U3.8(C9)
C10: C15.1 C16.2 R30.2 U3.6(C10)
C11: C15.2 R27.2 U3.4(C11)
C12: R26.2 U3.2(C12)
COL: C20.1 Q2.2 R33.2
DRIVE: Q2.1 U3.38(DRIVE)
F1: F1.2 J2.1
F2: F2.1 J2.9
F3: F3.2 J2.2
F4: F4.1 J2.10
F5: F5.2 J2.3
F6: F6.2 J2.4
F7: F7.2 J2.5
F8: F8.2 J2.6
F9: F9.2 J2.7
F10: F10.1 J2.11
F11: F11.2 J2.8
IBIAS: R28.2 U3.45(IBIAS)
ICMP: R25.1 R28.1 U3.46(ICMP)
PG1: F1.1 R49.1 R50.2
PG2: F2.2 R47.1 R48.1
PG3: F3.1 R45.1 R46.1
PG4: F4.2 R43.1 R44.1
PG5: F5.1 R41.1 R42.1
PG6: F6.1 R39.1 R40.1
PG7: F7.1 R37.1 R38.1
PG8: F8.1 R35.1 R36.1
PG9: F9.1 R32.1 R34.1
PG10: F10.2 R30.1 R31.1
PG11: F11.1 R24.1 R26.1 R27.1 R29.1 R178.1
S1: R50.1 U3.25(S1)
S2: R48.2 U3.23(S2)
S3: R46.2 U3.21(S3)
S4: R44.2 U3.19(S4)
S5: R42.2 U3.17(S5)
S6: R40.2 U3.15(S6)
S7: R38.2 U3.13(S7)
S8: R36.2 U3.11(S8)
S9: R34.2 U3.9(S9)
S10: R31.2 U3.7(S10)
S11: R29.2 U3.5(S11)
S12: R178.2 U3.3(S12)
VREF1: C24.1 U3.35(VREF1)
VREF2: C23.1 U3.34(VREF2)
VREG: C21.1 Q2.3 U3.37(VREG) U3.40(ISOMD)
NetD16_1: D16.1 R179.1
NetD16_2: D16.2 U3.28(GPIO2)
NetU3_41: U3.41(CSB_(IMA)) ; port IMA
NetU3_42: U3.42(SCK_(IPA)) ; port IPA
NetU3_47: U3.47(IMB) ; port IMB
NetU3_48: U3.48(IPB) ; port IPB

Not connected (* = marked no-connect by the designer): J2 0*; U3 27(GPIO1)* 29(GPIO3)* 32(GPIO4)* 33(GPIO5)* 39(WDT)* 43(SDI_(NC))* 44(SDO_(N))*

### Notes on the sheet
- (near R24) R26 connected as such to avoid leakage through R27 into C12, which would have introduced error in the C11 measurement
- LTC6811-1 enables multiple devices to connect in a daisy chain with one host processor connection for all devices
- Connecting ISOMD to VREG configures pins 41 to 44 of the LTC6811 for 2-wire isolated interface (isoSPI) mode
- Connector
- LED included for debugging purposes.
- V- will be the total volltage of the previous group of cell and GND for the bottom group
- (near C29) Note: Cell filtering setup is based on datasheet recommendations.
- LTC6811

### Library data of the parts
C14 C20 = CMP-019-0364-1: CAP CER 0.1UF 100V X7S 0603; Manufacturer: TDK Corporation; Unit Price (USD): 0.39; Tolerance: 10%; ComponentLink1URL: https://product.tdk.com/info/en/catalog/datasheets/mlcc_highreliability_midvoltage_en.pdf?ref_disty=digikey; Size / Dimension: 0.063" L x 0.031" W (1.60mm x 0.80mm); Case/Package: 0603 (1608 Metric); ComponentLink1Description: Series Datasheet; Operating Temperature: -55°C ~ 125°C; Mounting Type: Surface Mount, MLCC; Part Status: Active; Thickness (Max): 0.031" (0.80mm); Manufacturer Part Number: CGJ3E3X7S2A104K080AA; Series: CGJ; Digi-Key Part Number: 445-9154-1-ND; Temperature Coefficient: X7S; Applications: AEC-Q200
  C14: Voltage - Rated: 100V
C15-C19 C22 C25-C29 = CMP-019-0544-1: CAP CER 10000PF 50V C0G 0603; Manufacturer: TDK Corporation; Unit Price (USD): 0.3; Tolerance: 5%; Temperature Coefficient: C0G, NP0; Mounting Type: Surface Mount, MLCC; ComponentLink1URL: https://product.tdk.com/info/en/catalog/datasheets/mlcc_automotive_general_en.pdf?ref_disty=digikey; Size / Dimension: 0.063" L x 0.031" W (1.60mm x 0.80mm); Digi-Key Part Number: 445-6916-1-ND; Part Status: Active; Series: CGA; Manufacturer Part Number: CGA3E2C0G1H103J080AA; Thickness (Max): 0.035" (0.90mm); Operating Temperature: -55°C ~ 125°C; ComponentLink1Description: Series Datasheet; Voltage - Rated: 50V; Applications: AEC-Q200; Case/Package: 0603 (1608 Metric)
C21 C23 C24 = CMP-019-0890-1: CAP CER 1UF 50V X5R 0805; Manufacturer: TDK Corporation; Tolerance: 10%; Unit Price (USD): 0.48; Operating Temperature: -55°C ~ 85°C; ComponentLink1Description: Series Datasheet; Size / Dimension: 0.079" L x 0.049" W (2.00mm x 1.25mm); Digi-Key Part Number: 445-12703-1-ND; Thickness (Max): 0.057" (1.45mm); Manufacturer Part Number: CGA4J3X5R1H105K125AB; ComponentLink1URL: https://product.tdk.com/info/en/catalog/datasheets/mlcc_automotive_general_en.pdf?ref_disty=digikey; Mounting Type: Surface Mount, MLCC; Series: CGA; Part Status: Active; Case/Package: 0805 (2012 Metric); Temperature Coefficient: X5R; Applications: AEC-Q200
  C23 C24: Voltage - Rated: 50V
D16 = CMP-007-00000-1: as D20 on sheet sheet1; Min Operating Temperature: -30°C; Width: 0.8mm; Case/Package: 0603; Mount: Surface Mount; Illumination Color: Orange; Case Code (Metric): 1608; Length: 1.6mm; Height: 0.35mm; Max Operating Temperature: 85°C; Color: Orange; Number of Pins: 2; Package Quantity: 1; Radiation Hardening: No; Lens Transparency: Clear; Case Code (Imperial): 0603; Packaging: Tape and Reel
F1-F11 = C2Q 250: FUSE BOARD MNT 250MA 32VAC 63VDC; Manufacturer: Bel Fuse Inc.; Type: Board Mount (Cartridge Style Excluded); Voltage Rating - AC: 32V; Voltage Rating - DC: 63V; Response Time: Fast Blow; Breaking Capacity @ Rated Voltage: 35A AC, 50A DC; Melting I²t: 0.002; Approval Agency: CE, cURus; Manufacturer Part Number: C2Q 250; ComponentLink1URL: https://belfuse.com/resources/datasheets/circuitprotection/ds-cp-c2q-series.pdf; ComponentLink1Description: Datasheet; Current Rating: 250mA; Digi-Key Part Number: 507-1086-1-ND; Part Status: Active; Other: -; Operating Temperature: -55°C ~ 125°C; Package / Case: 0603 (1608 Metric); Mounting Type: Surface Mount; Height (Max): 0.019" (0.48mm); Size / Dimension: 0.063" L x 0.032" W x 0.019" H (1.60mm x 0.82mm x 0.48mm)
J2 = GT8E-12DP-DS: CONN HEADER R/A 12POS 2MM; Manufacturer: Hirose Electric Co Ltd; Connector Type: Header, Shrouded; Number of Positions: 12; Pitch: 0.079" (2.00mm); Gender: Female; Supplier 1: Mouser; RoHS: RoHS Compliant; Category: Automotive Connectors; Stock 1: 160; Pricing 1: 1=4.32, 10=4.14, 25=3.62, 100=3.46, 250=3.02, 500=2.93, 1000=2.50, 2500=2.32, 5000=2.24 (AUD); ComponentLink1URL: https://www.mouser.com/datasheet/2/185/GT8E_catalog-939506.pdf; ComponentLink1Description: Datasheet; Supplier Part Number 1: 798-GT8E-12DP-DS; Color: Black; Contact Finish: Tin; Contact Type: Male Pin; Fastening Type: Latch Lock; Features: Board Guide; Mounting Type: Through Hole, Right Angle; Number of Rows: 2; Termination: Solder; Manufacturer Part Number: GT8E-12DP-DS; Digi-Key Part Number: H122078-ND; Part Status: Active; Operating Temperature: -; Height (Max): 0.39" (10mm); Size / Dimension: 0.882" L x 0.585" W (22.4mm x 14.85mm); Rated Voltage: -; Current Rating: -
Q2 = CMP-039-0000-1: TRANS NPN 100V 2A SOT223-4; Manufacturer: ON Semiconductor; Frequency - Transition: 100MHz; Current - Collector Cutoff (Max): 100nA (ICBO); Power - Max: 800mW; DC Current Gain (hFE) (Min) @ Ic, Vce: 120 @ 500mA, 2V; Vce Saturation (Max) @ Ib, Ic: 180mV @ 200mA, 2A; Case/Package: TO-261-4, TO-261AA; Part Status: Active; ComponentLink1Description: Datasheet; Digi-Key Part Number: NSV1C201MZ4T1GOSCT-ND; Mounting Type: Surface Mount; Operating Temperature: -55°C ~ 150°C (TJ); Current - Collector (Ic) (Max): 2A; Supplier Device Package: SOT-223 (TO-261); Manufacturer Part Number: NSV1C201MZ4T1G; Height (Max): 1.65mm; Size / Dimension: 6.5mm L x 3.5mm W; Transistor Type: NPN; Voltage - Collector Emitter Breakdown (Max): 100V; ComponentLink1URL: http://www.onsemi.com/pub/Collateral/NSS1C201MZ4-D.PDF
R24 = CMP-038-1390-1: RES SMD 100 OHM 1% 1/2W 0805; Manufacturer: Panasonic Electronic Components; Unit Price (USD): 0.17; Temperature Coefficient: ±100ppm/°C; Power (Watts): 0.5W, 1/2W; Tolerance: 1%; Operating Temperature: -55°C ~ 155°C; Series: ERJ; ComponentLink1Description: Datasheet; Height - Seated (Max): 0.028" (0.70mm); Supplier Device Package: 0805; Manufacturer Part Number: ERJ-P06F1000V; Composition: Thick Film; Features: Automotive AEC-Q200, Pulse Withstanding; Case/Package: 0805 (2012 Metric); Size / Dimension: 0.079" L x 0.049" W (2.00mm x 1.25mm); Digi-Key Part Number: P16057CT-ND; ComponentLink1URL: https://industrial.panasonic.com/cdbs/www-data/pdf/RDO0000/AOA0000C331.pdf
R25 = CMP-038-2035-1: RES SMD 604 OHM 1% 1/10W 0603; Manufacturer: Panasonic Electronic Components; Unit Price (USD): 0.1; Power (Watts): 0.1W, 1/10W; Temperature Coefficient: ±100ppm/°C; Features: Automotive AEC-Q200; ComponentLink1URL: https://industrial.panasonic.com/cdbs/www-data/pdf/RDA0000/AOA0000C304.pdf; Case/Package: 0603 (1608 Metric); Series: ERJ; ComponentLink1Description: Datasheet; Digi-Key Part Number: P604HCT-ND; Operating Temperature: -55°C ~ 155°C; Tolerance: 1%; Composition: Thick Film; Manufacturer Part Number: ERJ-3EKF6040V; Height - Seated (Max): 0.022" (0.55mm); Size / Dimension: 0.063" L x 0.031" W (1.60mm x 0.80mm); Supplier Device Package: 0603
R26 = CMP-038-1387-1: as R2 on sheet sheet1; Manufacturer Part Number: ERJ-3EKF1000V; ComponentLink1Description: Datasheet; ComponentLink1URL: https://industrial.panasonic.com/cdbs/www-data/pdf/RDA0000/AOA0000C304.pdf; Digi-Key Part Number: P100HCT-ND; Series: ERJ; Tolerance: 1%; Composition: Thick Film; Features: Automotive AEC-Q200; Operating Temperature: -55°C ~ 155°C; Supplier Device Package: 0603; Size / Dimension: 0.063" L x 0.031" W (1.60mm x 0.80mm); Height - Seated (Max): 0.022" (0.55mm); Case/Package: 0603 (1608 Metric)
R27 R30 R32 R35 R37 R39 R41 R43 R45 R47 R49 = CMP-038-0571-1: RES SMD 10 OHM 1% 1/4W 0603; Manufacturer: Panasonic Electronic Components; Power (Watts): 0.25W, 1/4W; Temperature Coefficient: ±100ppm/°C; Unit Price (USD): 0.14; Features: Automotive AEC-Q200, Pulse Withstanding; Operating Temperature: -55°C ~ 155°C; Supplier Device Package: 0603; Case/Package: 0603 (1608 Metric); Composition: Thick Film; ComponentLink1Description: Datasheet; Height - Seated (Max): 0.022" (0.55mm); Tolerance: 1%; ComponentLink1URL: https://industrial.panasonic.com/cdbs/www-data/pdf/RDO0000/AOA0000C331.pdf; Digi-Key Part Number: P10.00BYCT-ND; Size / Dimension: 0.063" L x 0.031" W (1.60mm x 0.80mm); Manufacturer Part Number: ERJ-PA3F10R0V; Series: ERJ
R28 = CMP-038-2336-1: RES SMD 1.4K OHM 1% 1/10W 0603; Manufacturer: Panasonic Electronic Components; Unit Price (USD): 0.1; Power (Watts): 0.1W, 1/10W; Temperature Coefficient: ±100ppm/°C; Operating Temperature: -55°C ~ 155°C; ComponentLink1URL: https://industrial.panasonic.com/cdbs/www-data/pdf/RDA0000/AOA0000C304.pdf; Features: Automotive AEC-Q200; Height - Seated (Max): 0.022" (0.55mm); Case/Package: 0603 (1608 Metric); Tolerance: 1%; Manufacturer Part Number: ERJ-3EKF1401V; Size / Dimension: 0.063" L x 0.031" W (1.60mm x 0.80mm); Digi-Key Part Number: P1.40KHCT-ND; Supplier Device Package: 0603; ComponentLink1Description: Datasheet; Composition: Thick Film; Series: ERJ
R29 R31 R34 R36 R38 R40 R42 R44 R46 R48 R50 R178 = CMP-038-0980-1: RES SMD 33 OHM 1% 1/4W 0603; Manufacturer: Panasonic Electronic Components; Temperature Coefficient: ±100ppm/°C; Power (Watts): 0.25W, 1/4W; Unit Price (USD): 0.14; Features: Automotive AEC-Q200, Pulse Withstanding; ComponentLink1URL: https://industrial.panasonic.com/cdbs/www-data/pdf/RDO0000/AOA0000C331.pdf; Height - Seated (Max): 0.022" (0.55mm); Manufacturer Part Number: ERJ-PA3F33R0V; Series: ERJ; Supplier Device Package: 0603; Size / Dimension: 0.063" L x 0.031" W (1.60mm x 0.80mm); Tolerance: 1%; Operating Temperature: -55°C ~ 155°C; Digi-Key Part Number: P33.00BYCT-ND; ComponentLink1Description: Datasheet; Composition: Thick Film; Case/Package: 0603 (1608 Metric)
R33 = CMP-038-1389-1: as R7 on sheet sheet1; Size / Dimension: 0.063" L x 0.031" W (1.60mm x 0.80mm); Manufacturer Part Number: ERJ-PA3F1000V; Tolerance: 1%; Features: Automotive AEC-Q200, Pulse Withstanding; ComponentLink1URL: https://industrial.panasonic.com/cdbs/www-data/pdf/RDO0000/AOA0000C331.pdf; ComponentLink1Description: Datasheet; Operating Temperature: -55°C ~ 155°C; Height - Seated (Max): 0.022" (0.55mm); Series: ERJ; Case/Package: 0603 (1608 Metric); Composition: Thick Film; Supplier Device Package: 0603; Digi-Key Part Number: P100BYCT-ND
R179 = CMP-038-1734-1: as R174 on sheet sheet1; Case/Package: 0603 (1608 Metric); Size / Dimension: 0.063" L x 0.031" W (1.60mm x 0.80mm); Features: Automotive AEC-Q200, Pulse Withstanding; Tolerance: 1%; Digi-Key Part Number: P270BYCT-ND; Manufacturer Part Number: ERJ-PA3F2700V; Series: ERJ; ComponentLink1URL: https://industrial.panasonic.com/cdbs/www-data/pdf/RDO0000/AOA0000C331.pdf; Operating Temperature: -55°C ~ 155°C; Height - Seated (Max): 0.022" (0.55mm); Composition: Thick Film; Supplier Device Package: 0603; ComponentLink1Description: Datasheet
U3 = CMP-029-0000-3: MULTICELL BAT MON S; Manufacturer: Linear Technology/Analog Devices; Protection: Over/Under Voltage; Interface: I²C, SPI; Other: Number of cells: 1 ~ 12; Battery Chemistry: Multi-Chemistry; Output Type: -; Supply Current: -; Output Current: -; Mounting Type: Surface Mount; Case/Package: 48-FSOP (0.209", 5.30mm Width); Digi-Key Part Number: LTC6811HG-1#3ZZTRPBFCT-ND; Size / Dimension: 0.47" L x 0.24" W (12mm x 6mm); Operating Temperature: -40°C ~ 125°C; ComponentLink1Description: Datasheet; Supply Voltage: -; Topology: -; ComponentLink1URL: http://www.linear.com/docs/43171; Height (Max): 0.043" (1.1mm); Frequency: -; Part Status: Active; Manufacturer Part Number: LTC6811HG-1#3ZZTRPBF; Output Voltage: -; Number of Outputs: -; Type: Battery Monitor

## Assembly variants
BOM for BMS_11_1_0: not fitted R80 R81 R188 R189